# EAGLE design wisleep_revB (EAGLE 6.5.0)

## Sheet 1 of 2
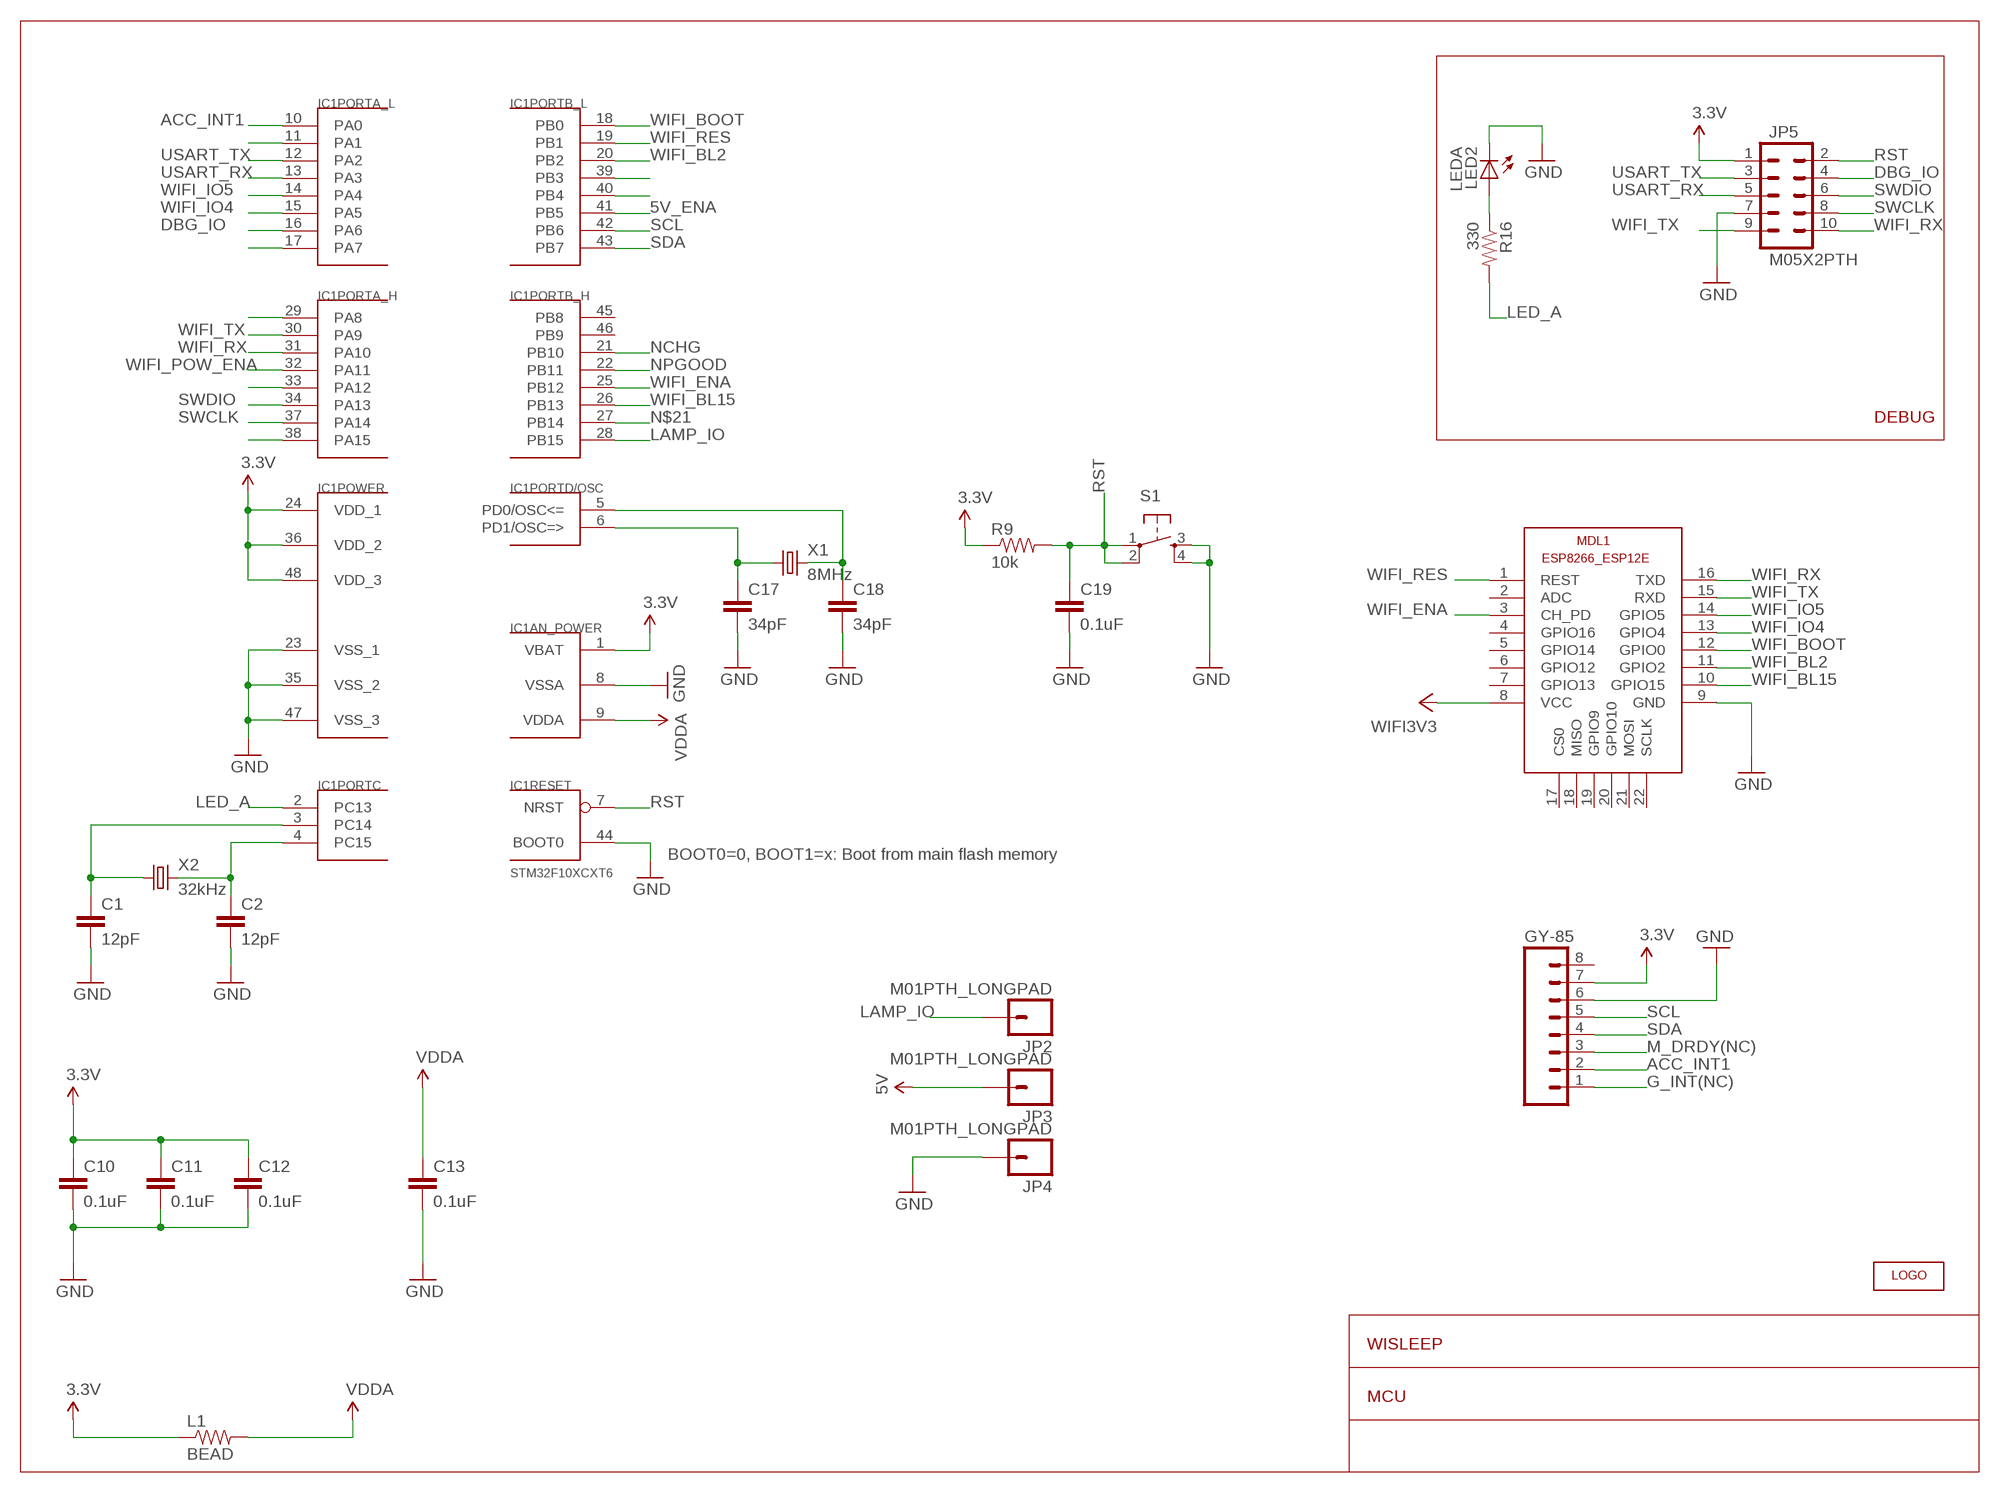
[diagram p0: schematic, sheet 1]

### Parts
C1  12pF  CAP0402  [C0402]
C2  12pF  CAP0402  [C0402]
C10  0.1uF  CAP0402  [C0402]
C11  0.1uF  CAP0402  [C0402]
C12  0.1uF  CAP0402  [C0402]
C13  0.1uF  CAP0402  [C0402]
C17  34pF  CAP0402  [C0402]
C18  34pF  CAP0402  [C0402]
C19  0.1uF  CAP0402  [C0402]
GY-85  M08  [1X08]
IC1  STM32F10XCXT6  [TQFP48]
JP2  M01PTH_LONGPAD  [1X01_LONGPAD]
JP3  M01PTH_LONGPAD  [1X01_LONGPAD]
JP4  M01PTH_LONGPAD  [1X01_LONGPAD]
JP5  M05X2PTH  [AVR_ICSP]
L1  BEAD  RESISTOR0603  [0603_GEN]
LED2  LEDA  LED0603  [LED-0603]
MDL1  ESP8266-12EESP8266-ESP12E  [ESP8266-ESP12E]
R9  10k  RESISTOR0402  [C0402]
R16  330  RESISTOR0402  [C0402]
S1  TAC_SWITCHSMD  [TACTILE_SWITCH_SMD]
U$7  LOGOLOGO  [LOGO]
X1  8MHz  CRYSTALOWN5X3.2_7A  [CRYSTAL_SMD_5X3.2_7A]
X2  32kHz  CRYSTAL  [CRYSTAL_SMD_2X0.6]

### Nets
3.3V: C10.1 C11.1 C12.1 GY-85.7 IC1.1(AN_POWER:VBAT) IC1.24(POWER:VDD_1) IC1.36(POWER:VDD_2) IC1.48(POWER:VDD_3) JP5.1 L1.1 R9.1 ; also sheet 2
5V: JP3.1 ; also sheet 2
5V_ENA: IC1.41(PORTB_L:PB5) ; also sheet 2
ACC_INT1: GY-85.2 IC1.10(PORTA_L:PA0)
DBG_IO: IC1.16(PORTA_L:PA6) JP5.4
G_INT(NC): GY-85.1
GND: C1.2 C2.2 C10.2 C11.2 C12.2 C13.2 C17.2 C18.2 C19.2 GY-85.6 IC1.8(AN_POWER:VSSA) IC1.23(POWER:VSS_1) IC1.35(POWER:VSS_2) IC1.44(RESET:BOOT0) IC1.47(POWER:VSS_3) JP4.1 JP5.7 LED2.C MDL1.9(GND) S1.3 S1.4 ; also sheet 2
LAMP_IO: IC1.28(PORTB_H:PB15) JP2.1
LED_A: IC1.2(PORTC:PC13) R16.2
M_DRDY(NC): GY-85.3
N$1: C1.1 IC1.3(PORTC:PC14) X2.P$1
N$2: C2.1 IC1.4(PORTC:PC15) X2.P$2
N$5: LED2.A R16.1
N$17: IC1.11(PORTA_L:PA1)
N$20: IC1.17(PORTA_L:PA7)
N$21: IC1.27(PORTB_H:PB14)
N$22: IC1.33(PORTA_H:PA12)
N$23: IC1.38(PORTA_H:PA15)
N$27: IC1.40(PORTB_L:PB4)
N$28: IC1.29(PORTA_H:PA8)
NCHG: IC1.21(PORTB_H:PB10) ; also sheet 2
NPGOOD: IC1.22(PORTB_H:PB11) ; also sheet 2
OSCI: C18.1 IC1.5(PORTD/OSC:PD0/OSC<=) X1.P$2
OSCO: C17.1 IC1.6(PORTD/OSC:PD1/OSC=>) X1.P$1
PB3: IC1.39(PORTB_L:PB3)
RST: C19.1 IC1.7(RESET:NRST) JP5.2 R9.2 S1.1 S1.2
SCL: GY-85.5 IC1.42(PORTB_L:PB6)
SDA: GY-85.4 IC1.43(PORTB_L:PB7)
SWCLK: IC1.37(PORTA_H:PA14) JP5.8
SWDIO: IC1.34(PORTA_H:PA13) JP5.6
USART_RX: IC1.13(PORTA_L:PA3) JP5.5
USART_TX: IC1.12(PORTA_L:PA2) JP5.3
VCC: MDL1.8(VCC) ; supply symbol labelled WIFI3V3 ; also sheet 2
VDDA: C13.1 IC1.9(AN_POWER:VDDA) L1.2
WIFI_BL2: IC1.20(PORTB_L:PB2) MDL1.11(GPIO2)
WIFI_BL15: IC1.26(PORTB_H:PB13) MDL1.10(GPIO15)
WIFI_BOOT: IC1.18(PORTB_L:PB0) MDL1.12(GPIO0)
WIFI_ENA: IC1.25(PORTB_H:PB12) MDL1.3(CH_PD)
WIFI_IO4: IC1.15(PORTA_L:PA5) MDL1.13(GPIO4)
WIFI_IO5: IC1.14(PORTA_L:PA4) MDL1.14(GPIO5)
WIFI_POW_ENA: IC1.32(PORTA_H:PA11) ; also sheet 2
WIFI_RES: IC1.19(PORTB_L:PB1) MDL1.1(REST)
WIFI_RX: IC1.31(PORTA_H:PA10) JP5.10 MDL1.16(TXD)
WIFI_TX: IC1.30(PORTA_H:PA9) JP5.9 MDL1.15(RXD)
Unconnected: GY-85.8 IC1.45(PORTB_H:PB8) IC1.46(PORTB_H:PB9) MDL1.2(ADC) MDL1.4(GPIO16) MDL1.5(GPIO14) MDL1.6(GPIO12) MDL1.7(GPIO13) MDL1.17(CS0) MDL1.18(MISO) MDL1.19(GPIO9) MDL1.20(GPIO10) MDL1.21(MOSI) MDL1.22(SCLK)

### Notes on the sheet
- DEBUG
- BOOT0=0, BOOT1=x: Boot from main flash memory
- WISLEEP
- MCU

## Sheet 2 of 2
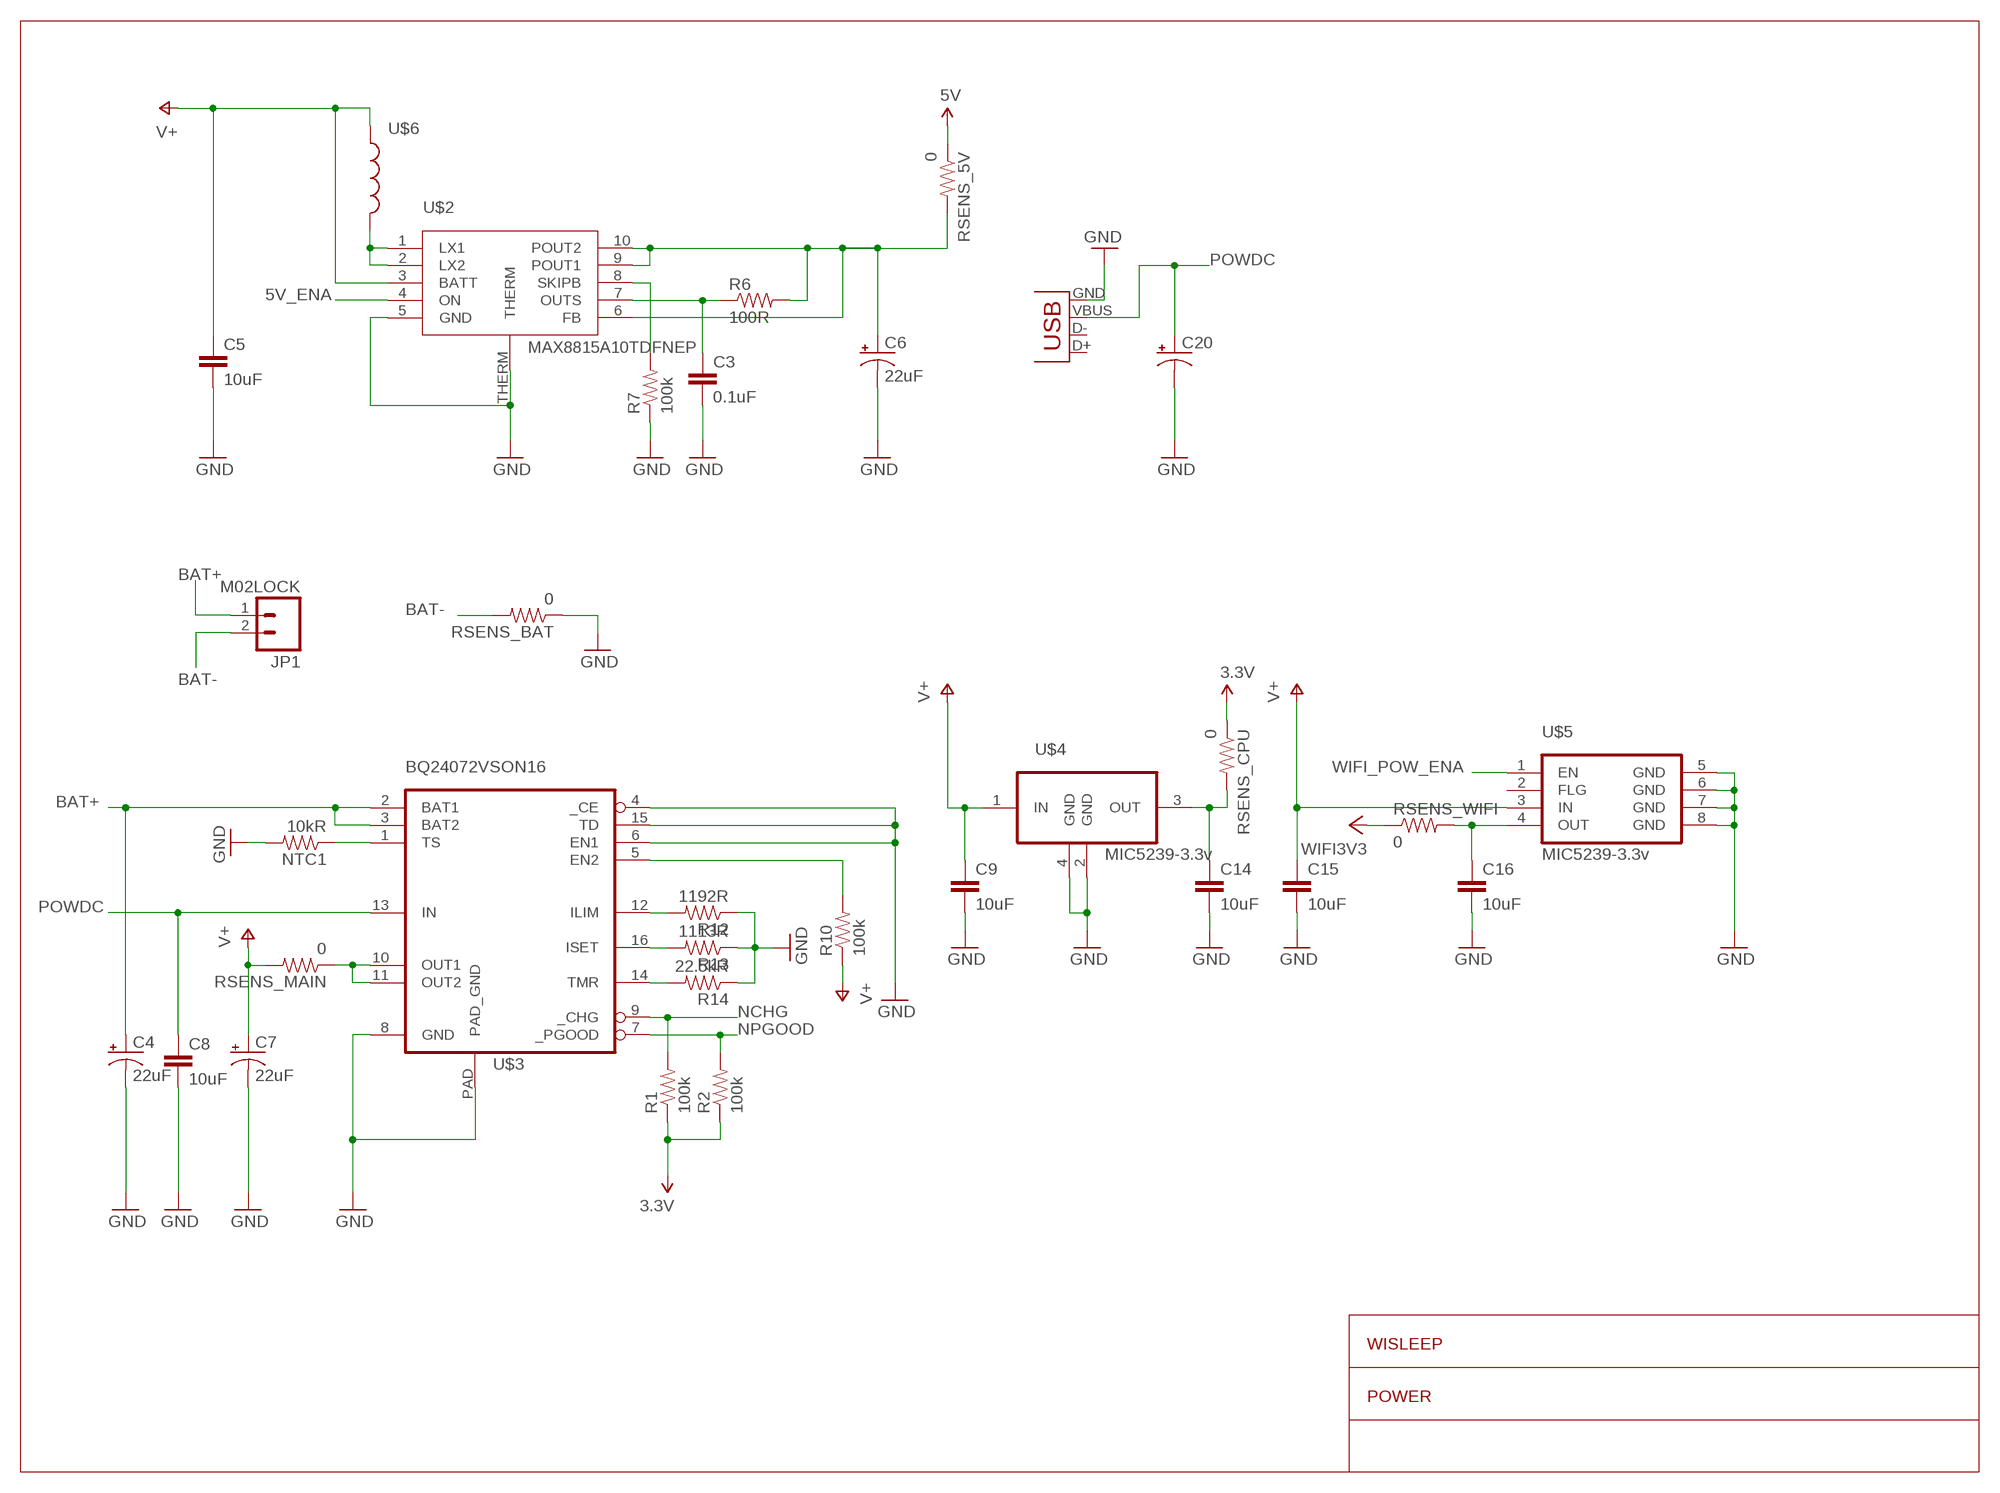
[diagram p1: schematic, sheet 2]

### Parts
C3  0.1uF  CAP0402  [C0402]
C4  22uF  CAP_POL1206_CASE-A  [EIA3216]
C5  10uF  CAP0402  [C0402]
C6  22uF  CAP_POL1206_CASE-A  [EIA3216]
C7  22uF  CAP_POL1206_CASE-A  [EIA3216]
C8  10uF  CAP0402  [C0402]
C9  10uF  CAP0402  [C0402]
C14  10uF  CAP0402  [C0402]
C15  10uF  CAP0402  [C0402]
C16  10uF  CAP0402  [C0402]
C20  CAP_POL6032  [EIA6032]
JP1  M02LOCK  [1X02_LOCK]
NTC1  10kR  RESISTOR0402  [C0402]
R1  100k  RESISTOR0402  [C0402]
R2  100k  RESISTOR0402  [C0402]
R6  100R  RESISTOR0402  [C0402]
R7  100k  RESISTOR0402  [C0402]
R10  100k  RESISTOR0402  [C0402]
R12  1192R  RESISTOR0402  [C0402]
R13  1113R  RESISTOR0402  [C0402]
R14  22.5kR  RESISTOR0402  [C0402]
RSENS_5V  0  RESISTOR0402  [C0402]
RSENS_BAT  0  RESISTOR0402  [C0402]
RSENS_CPU  0  RESISTOR0402  [C0402]
RSENS_MAIN  0  RESISTOR0402  [C0402]
RSENS_WIFI  0  RESISTOR0402  [C0402]
U$2  MAX8815A10TDFNEP  [10-TDFN-EP]
U$3  BQ24072VSON16  [VSON16]
U$4  MIC5239-3.3v  MIC5239SOT223SOT223  [SOT223]
U$5  MIC5239-3.3v  MIC5239-8MSOP  [MSOP08]
U$6  INDUCTOR3014  [INDUCTOR-3014]
X3  USB-MINIB  [USB-MINIB]

### Nets
3.3V: R1.1 R2.1 RSENS_CPU.1 ; also sheet 1
5V: RSENS_5V.1 ; also sheet 1
5V_ENA: U$2.4(ON) ; also sheet 1
BAT+: C4.A(+) JP1.1 U$3.2(BAT1) U$3.3(BAT2)
BAT-: JP1.2 RSENS_BAT.2
GND: C3.2 C4.C(-) C5.2 C6.C(-) C7.C(-) C8.2 C9.2 C14.2 C15.2 C16.2 C20.P$2(-) NTC1.2 R7.1 R12.1 R13.1 R14.1 RSENS_BAT.1 U$2.5(GND) U$2.THERM U$3.4(_CE) U$3.6(EN1) U$3.8(GND) U$3.15(TD) U$3.PAD(PAD_GND) U$4.2(GND) U$4.4(GND) U$5.5(GND) U$5.6(GND) U$5.7(GND) U$5.8(GND) X3.GND ; also sheet 1
N$3: C6.A(+) R6.2 RSENS_5V.2 U$2.6(FB) U$2.9(POUT1) U$2.10(POUT2)
N$4: RSENS_MAIN.1 U$3.10(OUT1) U$3.11(OUT2)
N$6: R14.2 U$3.14(TMR)
N$8: NTC1.1 U$3.1(TS)
N$9: R10.2 U$3.5(EN2)
N$11: R12.2 U$3.12(ILIM)
N$12: R13.2 U$3.16(ISET)
N$13: C14.1 RSENS_CPU.2 U$4.3(OUT)
N$14: C16.1 RSENS_WIFI.2 U$5.4(OUT)
N$15: U$2.1(LX1) U$2.2(LX2) U$6.P$2
N$16: C3.1 R6.1 U$2.7(OUTS)
N$19: R7.2 U$2.8(SKIPB)
NCHG: R1.2 U$3.9(_CHG) ; also sheet 1
NPGOOD: R2.2 U$3.7(_PGOOD) ; also sheet 1
POWDC: C8.1 C20.P$1(+) U$3.13(IN) X3.VBUS
V+: C5.1 C7.A(+) C9.1 C15.1 R10.1 RSENS_MAIN.2 U$2.3(BATT) U$4.1(IN) U$5.3(IN) U$6.P$1
VCC: RSENS_WIFI.1 ; supply symbol labelled WIFI3V3 ; also sheet 1
WIFI_POW_ENA: U$5.1(EN) ; also sheet 1
Unconnected: U$5.2(FLG) X3.D+ X3.D-

### Notes on the sheet
- WISLEEP
- POWER

## Library data of the parts
C1-C3 C5 C8-C19 = robot:CAP: Capacitor Standard 0603 ceramic capacitor, and 0.1" leaded capacitor.
C4 C6 C7 = robot:CAP_POL: Capacitor Polarized These are standard SMD and PTH capacitors. Normally 10uF, 47uF, and 100uF in electrolytic and tantalum varieties. Always verify the external diameter of the through hole cap, it varies with capacity, voltage, and manufacturer. The EIA devices should be standard.
C20 = SparkFun-Capacitors:CAP_POL: Capacitor Polarized These are standard SMD and PTH capacitors. Normally 10uF, 47uF, and 100uF in electrolytic and tantalum varieties. Always verify the external diameter of the through hole cap, it varies with capacity, voltage, and manufacturer. The EIA devices should be standard.
GY-85 = robot:M08: Header 8 Standard 8-pin 0.1" header. Use with straight break away headers (SKU : PRT-00116), right angle break away headers (PRT-00553), swiss pins (PRT-00743), machine pins (PRT-00117), and female headers (PRT-00115).
IC1 = stm32:STM32F10XCXT6: ST STM32F101/103 48pin LQFP
JP1 = SparkFun-Connectors:M02: Standard 2-pin 0.1" header. Use with - straight break away headers ( PRT-00116) - right angle break away headers (PRT-00553) - swiss pins (PRT-00743) - machine pins (PRT-00117) - female headers (PRT-00115) Molex polarized connector foot print use with: PRT-08233 with associated crimp pins and housings. 2.54_SCREWTERM for use with PRT-10571. 3.5mm Screw Terminal footprints for PRT-08084 5mm Screw Terminal footprints for use with PRT-08433
JP2-JP4 = SparkFun-Connectors:M01: Header 1 Standard 1-pin 0.1" header. Use with straight break away headers (SKU : PRT-00116), right angle break away headers (PRT-00553), swiss pins (PRT-00743), machine pins (PRT-00117), and female headers (PRT-00115).
JP5 = SparkFun-Connectors:M05X2: Header 5x2 Standard 10-pin dual row 0.1" header. Commonly used with AVR-ISP. Use with Spark Fun Electronics SKU: PRT-00778
L1 = robot:RESISTOR: Resistor Basic schematic elements and footprints for 0603, 1206, and PTH 1/10th watt (small) resistors.
LED2 = SparkFunEagle-6-6-07:LED: LEDs Standard schematic elements and footprints for 5mm, 3mm, 1206, and 0603 sized LEDs. 5mm - Spark Fun Electronics SKU : COM-00529 (and others)
MDL1 = ESP8266-ESP12E:ESP8266-12E: ESP8266-12E with additional I/O and GPIO04/05 corrected The author cannot warrant that this library is free from error or will meet your specific requirements. Created by PuceBaboon.com. Komagane, Nagano, JAPAN
NTC1 R1 R2 R6 R7 R9 R10 R12-R14 R16 RSENS_5V RSENS_BAT RSENS_CPU RSENS_MAIN RSENS_WIFI = SparkFunEagle-6-6-07:RESISTOR: Resistor Basic schematic elements and footprints for 0603, 1206, and PTH 1/10th watt (small) resistors.
S1 = SparkFun-Electromechanical:TAC_SWITCH: Momentary Switch Button commonly used for reset or general input. Spark Fun Electronics SKU : COM-00097 SMT- SWCH-08247; PROD_ID: SWCH-08247
U$2 = robot:MAX8815A
U$3 = robot:BQ24072: bq24072 1.5-A USB-Friendly Li-Ion Battery Charger and Power-Path Management IC
U$4 = robot:MIC5239SOT223
U$5 = robot:MIC5239-8
U$6 = robot:INDUCTOR: Inductors Basic Inductor/Choke - 0603 and 1206. Footprints are not proven and vary greatly between part numbers.
U$7 = robot:LOGO
X1 X2 = robot:CRYSTAL: Crystals Various standard crystals. Proven footprints. Spark Fun Electronics SKU : COM-00534
X3 = robot:USB: USB Connectors USB-B-PTH is fully proven SKU : PRT-00139 USB-miniB is fully proven SKU : PRT-00587 USB-A-H is throughly reviewed, but untested. Spark Fun Electronics SKU : PRT-00437 USB-B-SMT is throughly reviewed, but untested. Needs silkscreen touching up. USB-A-S has not been used/tested USB-MB-H has not been used/tested

## Board
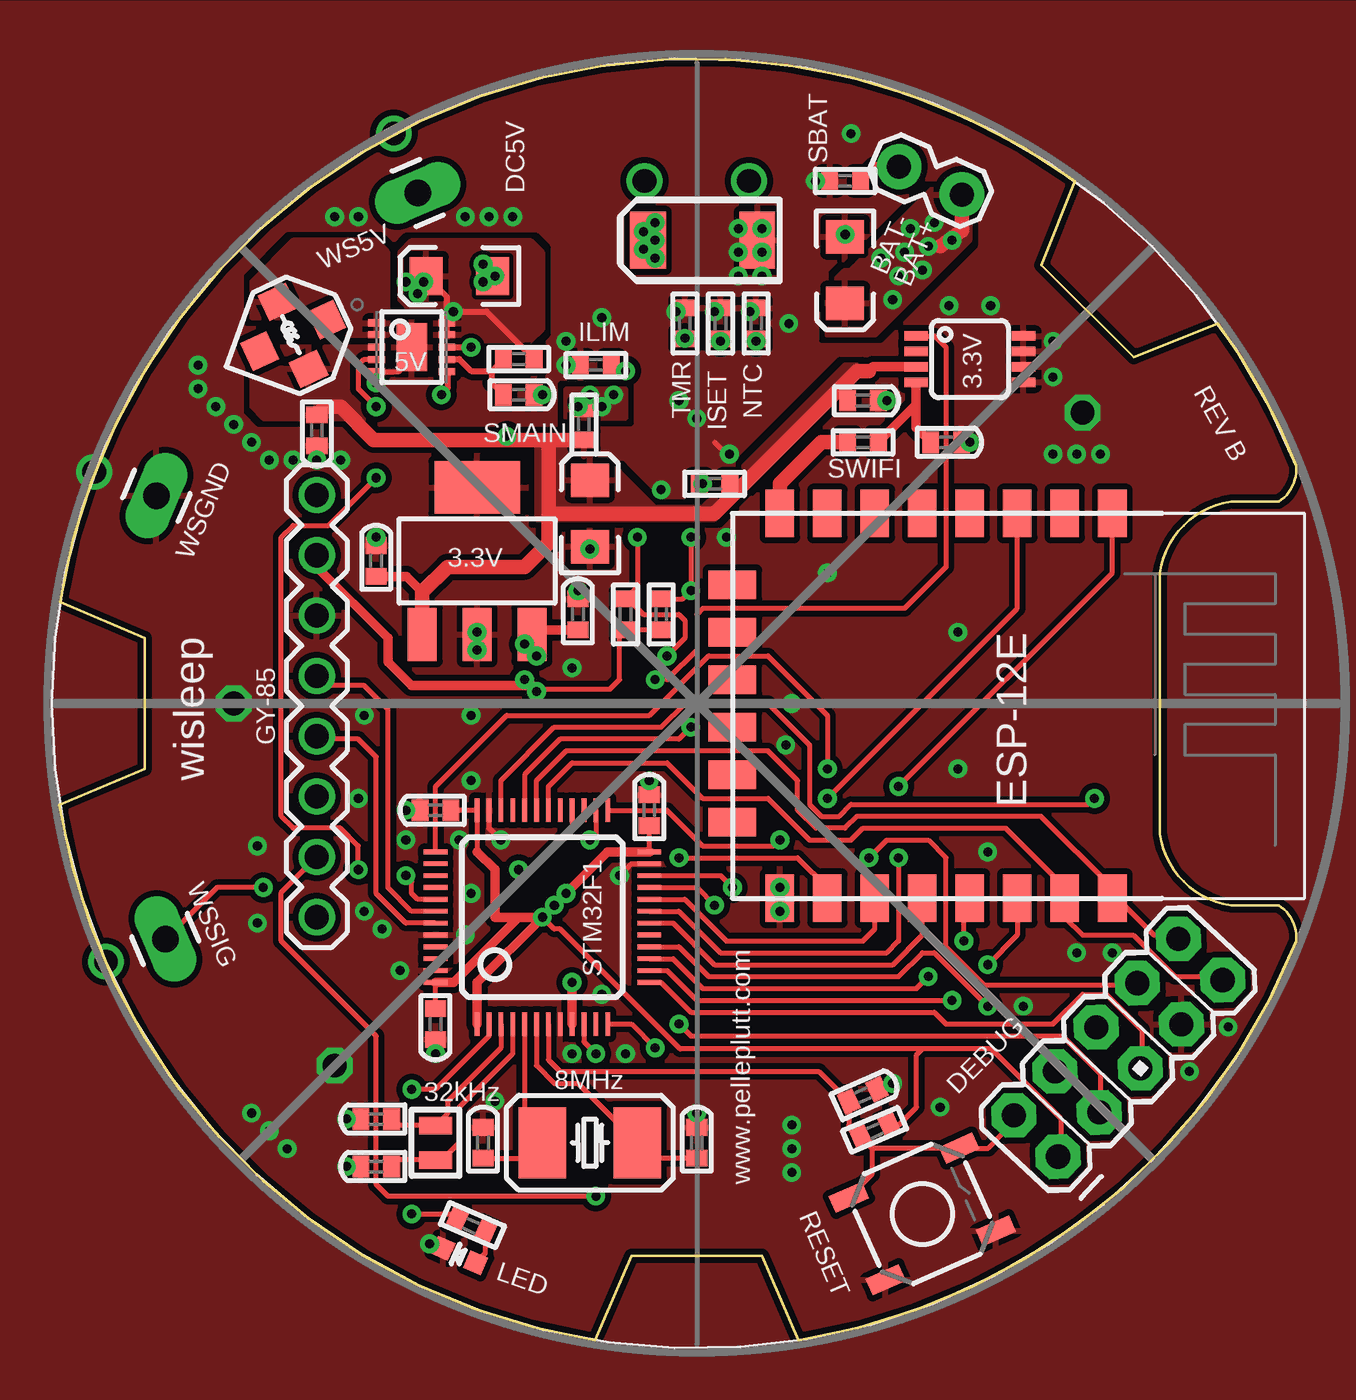
[diagram p2: board, top side]
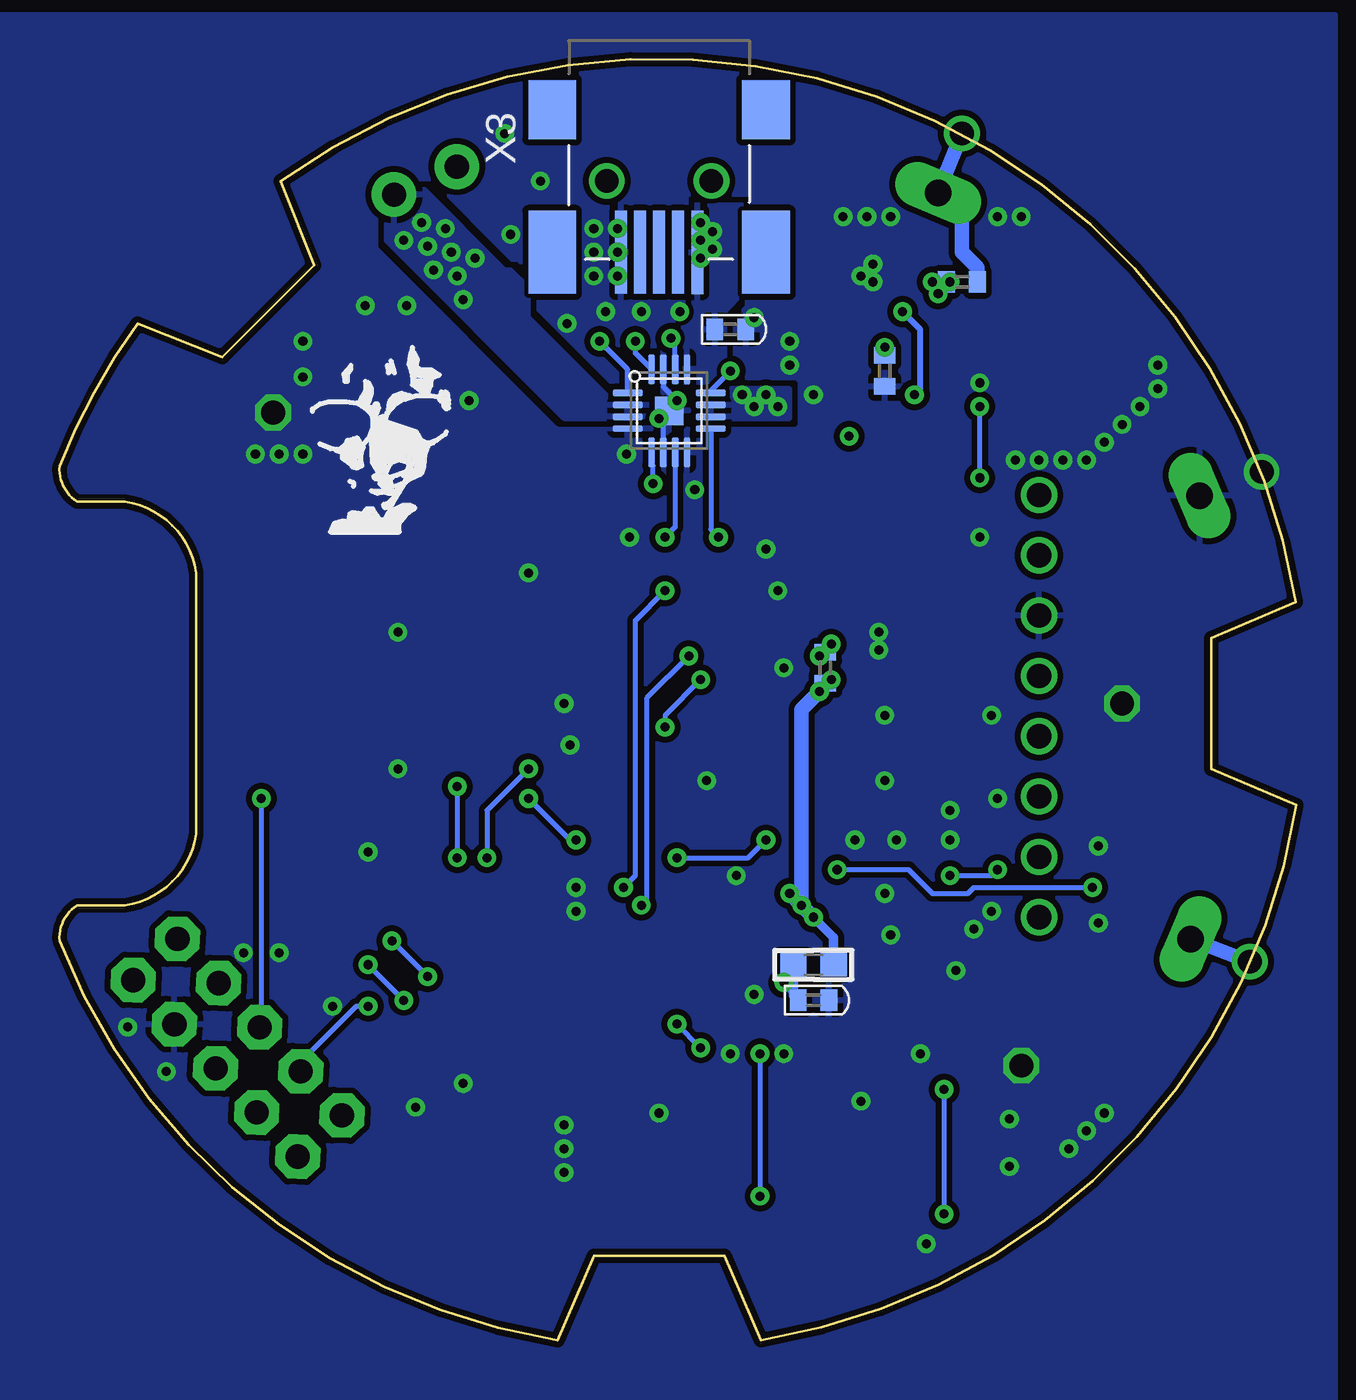
[diagram p3: board, bottom side, seen from below]

Size 52.09 x 53.93 mm. Coordinates in mm from the lower left corner, seen from the top.
Outline: 42.77,48.8 41.36,45.27 45.25,41.38 48.79,42.8 arc-14 52.09,36.81 arc-62 51.34,35.31 49.34,35.31 arc74 46.34,32.31 46.34,21.31 arc74 49.34,18.31 51.34,18.31 arc-62 52.09,16.81 arc-59 31.12,0 29.59,3.56 24.09,3.56 22.56,0 arc-72 0,22.53 3.59,24.06 3.59,29.56 0.03,31.08 arc-117 42.77,48.8
Copper layers (1*16): Top 0.035mm / dielectric 1.5mm / Bottom 0.035mm
Design rules "batchpcb_onthelimits *": minimum track width 7mil, minimum drill 15mil, track to track 7mil, track to pad 7mil, pad to pad 7mil, via to via 7mil, smd to smd 7mil, copper to edge 10mil, drill to drill 7mil, minimum pad ring 10mil, minimum via ring 8mil, stop-mask expansion 4mil, vias tented up to drill 15mil, thermal gap 10mil

### Footprints (pad centres in the part's own frame; a part is rotated, then mirrored left to right if it is on the bottom)
C0402 = smd 0.7 x 0.9: 1 -0.65,0; 2 0.65,0
EIA3216 = smd 1.4 x 1.6: A 1.4,0; C -1.4,0
EIA6032 = smd 1.5 x 2.4: P$1 -2.3,0; P$2 2.3,0
1X08 = drill 1.016: 1 0,0; 2 2.54,0; 3 5.08,0; 4 7.62,0; 5 10.16,0; 6 12.7,0; 7 15.24,0; 8 17.78,0
TQFP48 = smd 0.2 x 1: 1 -2.75,-4.5; 2 -2.25,-4.5; 3 -1.75,-4.5; 4 -1.25,-4.5; 5 -0.75,-4.5; 6 -0.25,-4.5; 7 0.25,-4.5; 8 0.75,-4.5; 9 1.25,-4.5; 10 1.75,-4.5; 11 2.25,-4.5; 12 2.75,-4.5; 25 2.75,4.5; 26 2.25,4.5; 27 1.75,4.5; 28 1.25,4.5; 29 0.75,4.5; 30 0.25,4.5; 31 -0.25,4.5; 32 -0.75,4.5; 33 -1.25,4.5; 34 -1.75,4.5; 35 -2.25,4.5; 36 -2.75,4.5 | smd 1 x 0.2: 13 4.5,-2.75; 14 4.5,-2.25; 15 4.5,-1.75; 16 4.5,-1.25; 17 4.5,-0.75; 18 4.5,-0.25; 19 4.5,0.25; 20 4.5,0.75; 21 4.5,1.25; 22 4.5,1.75; 23 4.5,2.25; 24 4.5,2.75; 37 -4.5,2.75; 38 -4.5,2.25; 39 -4.5,1.75; 40 -4.5,1.25; 41 -4.5,0.75; 42 -4.5,0.25; 43 -4.5,-0.25; 44 -4.5,-0.75; 45 -4.5,-1.25; 46 -4.5,-1.75; 47 -4.5,-2.25; 48 -4.5,-2.75
1X02_LOCK = drill 1.016 pad 1.88: 1 -0.178,0; 2 2.718,0
1X01_LONGPAD = drill 1.118 pad 1.88 long: 1 0,0
AVR_ICSP = drill 1.016 pad 1.88 octagon: 1 -1.27,5.08; 2 1.27,5.08; 3 -1.27,2.54; 4 1.27,2.54; 5 -1.27,0; 6 1.27,0; 7 -1.27,-2.54; 8 1.27,-2.54; 9 -1.27,-5.08; 10 1.27,-5.08
0603_GEN = smd 1.1 x 1: 1 -0.85,0; 2 0.85,0
LED-0603 = smd 0.8 x 0.8: A 0,-0.75; C 0,0.75
ESP8266-ESP12E = smd 2 x 1.2: 1 0,16; 2 0,14; 3 0,12; 4 0,10; 5 0,8; 6 0,6; 7 0,4; 8 0,2; 9 16.2,2; 10 16.2,4; 11 16.2,6; 12 16.2,8; 13 16.2,10; 14 16.2,12; 15 16.2,14; 16 16.2,16 | smd 1.2 x 2: 17 11,0; 18 3,0; 19 5,0; 20 13,0; 21 7,0; 22 9,0
TACTILE_SWITCH_SMD = smd 1.524 x 0.762: 1 -2.54,1.905; 2 2.54,1.905; 3 -2.54,-1.905; 4 2.54,-1.905
10-TDFN-EP = smd 0.7 x 0.3: 1 -1.48,1.025; 2 -1.48,0.525; 3 -1.48,0; 4 -1.48,-0.525; 5 -1.48,-1.025; 6 1.48,-1.025; 7 1.48,-0.525; 8 1.48,0; 9 1.48,0.525; 10 1.48,1.025 | smd 1.27 x 2.032: THERM 0,0
VSON16 = smd 1.25 x 0.28: 1 -1.75,0.75; 2 -1.75,0.25; 3 -1.75,-0.25; 4 -1.75,-0.75; 9 1.75,-0.75; 10 1.75,-0.25; 11 1.75,0.25; 12 1.75,0.75 | smd 0.28 x 1.25: 5 -0.75,-1.75; 6 -0.25,-1.75; 7 0.25,-1.75; 8 0.75,-1.75; 13 0.75,1.75; 14 0.25,1.75; 15 -0.25,1.75; 16 -0.75,1.75 | smd 1.2 x 1.2: PAD 0,0
SOT223 = smd 1.219 x 2.235: 1 -2.311,-3.099; 2 0,-3.099; 3 2.311,-3.099 | smd 3.6 x 2.2: 4 0,3.099
MSOP08 = smd 0.4 x 1: 1 -0.976,-2.263; 2 -0.326,-2.263; 3 0.324,-2.263; 4 0.974,-2.263; 5 0.974,2.262; 6 0.324,2.262; 7 -0.326,2.262; 8 -0.976,2.262
INDUCTOR-3014 = smd 1.3 x 1.2 rotated 45: NC1 -1.1,1.1 | smd 1.3 x 1.2 rotated 225: NC2 1.1,-1.1 | smd 1.3 x 1.2 rotated 135: P$1 -1.1,-1.1 | smd 1.3 x 1.2 rotated 315: P$2 1.1,1.1
CRYSTAL_SMD_5X3.2_7A = smd 2 x 3: P$1 -2,0; P$2 2,0
CRYSTAL_SMD_2X0.6 = smd 0.75 x 1.4: P$1 -0.725,0; P$2 0.725,0
USB-MINIB = smd 2.5 x 2: 1 -3,-4.5; 2 -3,4.5 | smd 3.5 x 2: 3 3,-4.5; 4 3,4.5 | smd 3.5 x 0.5: D+ 3,0; D- 3,0.8; GND 3,-1.6; ID 3,-0.8; VBUS 3.01,1.61 | drill 1 pad 1.27: P$1 0,2.2; P$2 0,-2.2

### Placement (x,y rotation side)
C1  13.34,9.31 180 top
C2  13.34,7.31 180 top
C3  19.34,39.81 0 top
C4  33.09,45.06 270 top
C5  10.84,38.31 270 top
C6  16.84,44.81 180 top
C7  22.34,34.81 90 top
C8  23.84,42.56 0 bottom
C9  13.34,32.81 90 top
C10  15.84,22.31 180 top
C11  24.84,22.31 90 top
C12  15.84,13.31 270 top
C13  20.34,14.31 0 bottom
C14  21.84,30.56 90 top
C15  33.84,39.56 0 top
C16  37.34,37.81 0 top
C17  26.84,8.31 90 top
C18  17.84,8.31 90 top
C19  33.84,10.31 24 top
C20  27.09,46.31 0 top
GY-85  10.84,17.81 90 top
IC1  20.34,17.81 0 top
JP1  37.84,48.31 156 top
JP2  4.47,16.89 203 top
JP3  15.09,48.31 113 top
JP4  4.08,35.56 337 top
JP5  44.59,12.31 137 top
L1  20.34,15.81 180 bottom
LED2  16.84,3.56 66 top
MDL1  28.34,34.81 270 top
NTC1  29.34,42.81 90 top
R1  23.84,30.56 90 top
R2  25.34,30.56 90 top
R6  19.34,41.31 0 top
R7  17.34,40.81 90 bottom
R9  34.34,8.81 204 top
R10  27.59,36.06 180 top
R12  22.59,41.06 0 top
R13  27.84,42.81 270 top
R14  26.34,42.81 270 top
R16  17.34,4.81 156 top
RSENS_5V  14.09,44.56 180 bottom
RSENS_BAT  33.09,48.81 0 top
RSENS_CPU  19.84,28.31 90 bottom
RSENS_MAIN  22.09,38.56 270 top
RSENS_WIFI  33.84,37.81 0 top
S1  36.34,5.31 24 top
U$2  14.84,41.81 0 top
U$3  26.41,39.13 0 bottom
U$4  17.59,32.81 0 top
U$5  38.34,41.31 270 top
U$6  9.84,42.31 70 top
U$7  38.44,38.35 0 bottom
X1  22.34,8.31 180 top
X2  15.84,8.31 270 top
X3  26.84,48.81 270 bottom

### Tracks (layer width: path | path; a pad name or v marks a point on that pad's centre or on a via)
3.3V  (via drill 0.38)
  Top 0.2: C12.1 IC1.48 | C10.1 IC1.36 17.59,20.56 | IC1.24 C11.1 | 36.34,12.26 39.24,12.26 42.17,9.33 42.17,7.84 JP5.1 | 36.34,12.26 26.14,12.26 21.09,17.31 20.84,17.31 v20.34,17.81 | R9.1 35.35,9.07 36.09,9.81 36.09,12.01 36.34,12.26 | 20.09,27.41 19.99,27.41 v19.59,27.81 19.69,27.81 20.09,27.41 | 20.09,27.41 23.19,27.41 23.59,27.81 23.59,29.66 R1.1 R2.1
  Top 0.4: 17.59,20.56 18.34,19.81 18.34,17.81 v20.34,17.81 | IC1.24 23.09,20.56 v21.34,18.81 | IC1.1 17.59,15.06 v20.34,17.81 | IC1.48 16.59,15.06 19.34,17.81 v20.34,17.81 | GY-85.7 10.84,32.56 13.84,29.56 13.84,28.56 14.84,27.56 19.74,27.56 RSENS_CPU.1 19.84,27.56 v20.09,27.31
  Bottom 0.4: L1.1 19.49,16.96 v20.34,17.81 | v19.59,27.81 19.69,27.81 RSENS_CPU.1 20.09,27.41 v20.09,27.31
  Bottom 0.6: v20.09,27.31 20.34,27.06 20.84,26.56 v20.84,18.31 | v20.84,18.31 v21.34,18.81 v20.34,17.81 v20.84,18.31
5V  (via drill 1 pad 0.8)
  Bottom 0.6: RSENS_5V.1 13.44,45.16 14.09,45.81 14.09,47.31 JP3.1 v14.09,50.81
5V_ENA  (via drill 0.38)
  Top 0.2: U$2.4 12.81,41.29 12.59,41.06 12.59,40.06 v13.34,39.31 | v12.59,19.81 12.59,20.81 11.84,21.56 9.84,21.56 9.34,22.06 9.34,33.81 9.84,34.31 11.34,34.31 v13.34,36.31 | IC1.41 15.09,18.56 14.84,18.81 14.84,19.31 v14.59,19.56
  Bottom 0.2: v13.34,36.31 v13.34,39.31 | v14.59,19.56 12.84,19.56 v12.59,19.81
ACC_INT1  (via drill 0.38)
  Top 0.2: IC1.10 22.09,12.56 v22.59,12.06 | v22.59,6.06 13.84,6.06 13.34,6.56 13.34,12.81 9.34,16.81 9.34,18.85 GY-85.2
  Bottom 0.2: v22.59,12.06 v22.59,6.06
BAT+  (via drill 0.38)
  Top 0.6: JP1.1 38,46.72 37.09,46.06
  other vias: 35.09,43.81 36.34,45.06 37.59,46.31 36.59,46.06 35.34,44.81 35.59,45.81 36.84,47.06 34.59,45.56 35.84,46.81
  pour Top (rank 2): 32.34,42.31 32.34,44.31 33.09,45.06 33.34,45.06 36.84,48.56 38.34,48.56 38.34,46.31 34.34,42.31
  pour Bottom: 27.34,39.56 28.84,39.56 32.34,43.06 32.34,44.31 33.09,45.06 33.34,45.06 36.84,48.56 38.34,48.56 38.34,46.31 30.84,38.81 27.34,38.81
BAT-
  Top 0.4: JP1.2 34.35,49.41 RSENS_BAT.2
DBG_IO  (via drill 0.38)
  Top 0.2: IC1.16 26.09,16.56 27.34,15.31 35.34,15.31 36.34,16.31 36.84,16.31 v39.09,14.06
  Bottom 0.2: v39.09,14.06 39.59,14.06 42.05,11.61 42.05,11.44 JP5.4
GND  (via drill 0.38 pad 0.69, 1, 1 pad 0.8)
  Top 0.2: U$2.THERM 14.34,41.31 14.34,40.81 14.31,40.79 U$2.5 13.36,40.33 v13.34,40.31 | IC1.35 18.09,21.56 v18.59,21.06 | IC1.23 24.09,20.06 v23.59,19.56 | 27.59,37.81 27.84,37.56 | NTC1.2 v29.09,43.31
  Top 0.6: v18.34,44.81 C6.C | C3.2 v20.34,39.81
  Bottom 0.2: U$3.15 26.66,40.13 v26.09,39.56 | U$3.6 26.66,38.63 v26.84,38.81
  other vias: 18.34,10.06 17.09,17.06 21.59,12.06 14.59,22.31 24.84,23.56 15.84,12.06 12.09,9.31 12.09,7.31 26.84,9.56 41.84,42.06 41.84,40.56 17.59,29.81 17.59,29.06 35.09,10.81 15.59,4.06 12.59,22.81 12.84,18.06 30.34,19.06 30.34,18.06 28.59,46.81 25.96,43.31 33.09,46.56 22.34,33.31 21.34,41.06 21.84,31.56 13.34,33.81 34.84,39.56 38.34,37.81 31.84,48.81 8.84,8.81 8.09,9.56 9.59,8.06 11.59,47.31 12.59,47.31 21.34,42.06 17.09,47.31 18.09,47.31 19.09,47.31 10.84,37.06 11.84,37.06 9.84,37.06 8.84,37.06 8.09,37.81 7.34,38.56 6.59,39.31 5.84,40.06 5.84,41.06 32.34,32.31 40.59,14.06 30.84,26.81 14.34,15.56 8.34,17.56 8.34,20.81 14.59,21.06 13.59,17.31 22.84,14.56 17.34,18.81 17.34,23.56 16.84,21.06 30.59,25.06 37.84,24.06 37.84,29.81 21.59,28.31 17.34,26.31 17.84,44.56 17.84,45.31 42.84,16.31 44.34,16.31 25.34,35.81 41.84,37.31 42.84,37.31 43.84,37.31 33.34,50.81 30.84,9.06 30.84,8.06 30.84,7.06 23.84,12.06 37.09,9.81 39.09,20.56 12.84,26.31 11.59,11.56 7.34,26.81 43.09,39.06 27.59,43.31 47.59,11.31 49.22,13.19 28.59,45.81 28.59,44.81 29.59,46.81 29.59,45.81 29.59,44.81 22.84,43.06 30.71,42.81 28.21,37.31 37.47,43.56 39.22,43.56 28.09,33.81 1.47,36.56
  pour Bottom (isolate 0.25, rank 2): -1.66,55.81 57.34,55.81 57.34,-2.69 -1.66,-2.69
  pour Top (isolate 0.25, rank 6): -2.66,56.31 56.84,56.31 56.84,-4.69 -2.66,-4.69
LAMP_IO  (via drill 0.38, 1 pad 0.8)
  Top 0.2: IC1.28 21.59,21.56 19.84,19.81 v19.34,19.81 | v8.59,19.06 6.64,19.06 JP2.1
  Bottom 0.2: v19.34,19.81 16.34,19.81 15.34,18.81 13.84,18.81 13.59,19.06 v8.59,19.06
  Bottom 0.6: JP2.1 v1.97,15.94
LED_A  (via drill 0.38)
  Top 0.2: IC1.2 18.09,12.81 15.84,10.56 v14.84,10.56 | v14.84,5.31 16.51,5.31 R16.2
  Bottom 0.2: v14.84,10.56 v14.84,5.31
N$1
  Top 0.2: IC1.3 18.59,12.31 16.34,10.06 16.34,9.54 X2.P$1 14.27,9.04 C1.1
N$2
  Top 0.2: IC1.4 19.09,12.06 16.84,9.81 16.84,8.31 16.11,7.58 X2.P$2 14.27,7.58 C2.1
N$3  (via drill 0.38, 0.38 pad 0.38)
  Top 0.2: U$2.6 16.34,40.81 16.34,40.8 | U$2.10 U$2.9 | 16.32,42.79 16.34,43.31
  Top 0.25: 16.34,43.31 v16.59,43.31 | v16.59,43.31 17.99,43.31 R6.2 | C6.A 16.32,43.93 U$2.10 16.59,43.11 v16.59,43.31 | 16.34,40.81 16.34,40.32 16.34,40.31 16.34,40.06 v16.09,39.81
  Bottom 0.25: v16.09,39.81 15.84,40.06 15.84,42.56 v16.59,43.31
  Bottom 0.6: RSENS_5V.2 15.19,44.41 v15.34,44.56 | v14.59,44.56 RSENS_5V.2 | 14.94,44.56 RSENS_5V.2
  other vias: 15.09,44.06
  pour Top (rank 2): 15.84,42.06 15.84,43.31 14.84,43.31 14.34,43.81 14.34,45.81 14.84,46.31 19.84,46.31 20.34,45.81 20.34,42.56 19.84,42.06
N$4  (via drill 0.38)
  Top 0.2: 22.24,39.06 RSENS_MAIN.1
  other vias: 23.34,39.81 22.84,39.31 22.34,39.81 21.84,39.31
  pour Top: 21.34,40.06 23.84,40.06 23.84,38.81 21.34,38.81
  pour Bottom: 21.34,40.06 23.84,40.06 23.84,39.56 24.84,39.56 24.84,38.81 21.34,38.81
N$5
  Top 0.2: R16.1 17.93,3.66 LED2.A
N$6  (via drill 0.38)
  Top 0.2: R14.2 v26.34,42.19
  Bottom 0.2: U$3.14 26.16,42.01 v26.34,42.19
N$8  (via drill 0.38)
  Top 0.2: v29.34,42.06 29.09,41.91 NTC1.1
  Bottom 0.2: U$3.1 28.16,40.88 v29.34,42.06
N$9  (via drill 0.38)
  Top 0.2: R10.2 v27.09,36.06
  Bottom 0.2: U$3.5 27.16,36.88 27.09,36.81 v27.09,36.06
N$11  (via drill 0.38)
  Top 0.2: v23.84,40.81 23.49,40.81 R12.2
  Bottom 0.2: U$3.12 24.66,39.99 v23.84,40.81
N$12  (via drill 0.38)
  Top 0.2: v27.84,42.06 R13.2
  Bottom 0.2: U$3.16 | U$3.16 27.84,41.56 v27.84,42.06
N$13  (via drill 0.38)
  Top 0.2: v19.59,29.31 19.59,29.4 U$4.3
  Top 0.4: C14.1 20.1,29.91 U$4.3
  Bottom 0.4: v19.59,29.31 19.59,29.21 RSENS_CPU.2 19.99,28.81 v20.09,28.81
N$14
  Top 0.4: U$5.4 36.08,39.4 | 36.08,39.4 RSENS_WIFI.2 | 36.08,39.4 36.08,38.42 C16.1
N$15
  pour Top (isolate 0.25, rank 2): 10.34,43.06 11.09,42.31 13.84,42.31 13.84,45.81 13.34,46.31 9.84,46.31 8.09,44.56 8.09,43.06
N$16
  Top 0.25: U$2.7 16.34,41.31 16.84,41.31 17.34,40.81 18.19,40.81 | 18.19,40.81 R6.1 | 18.19,40.81 18.19,40.31 C3.1
N$19  (via drill 0.38 pad 0.69)
  Top 0.25: U$2.8 v17.34,41.81
  Bottom 0.25: R7.2 v17.34,41.81
NCHG  (via drill 0.38)
  Top 0.2: IC1.21 26.84,19.06 v27.59,18.31 | v24.34,33.81 24.34,31.71 R1.2 23.94,31.21 24.59,30.56 26.09,30.56 26.34,30.31 26.34,29.56 v25.59,28.81
  Bottom 0.2: v27.59,18.31 27.34,18.31 27.34,27.06 v25.59,28.81 | U$3.9 24.66,34.13 v24.34,33.81
NPGOOD  (via drill 0.38)
  Top 0.2: IC1.22 27.84,19.56 v28.34,19.06 | v26.59,33.81 v26.59,31.56 26.24,31.21 R2.2
  Bottom 0.2: v28.34,19.06 27.84,19.56 27.84,30.31 v26.59,31.56 | U$3.7 26.16,34.24 v26.59,33.81
OSCI
  Top 0.2: IC1.5 19.59,9.06 X1.P$2 19.69,7.66 C18.1
OSCO
  Top 0.2: IC1.6 20.09,11.56 20.84,10.81 21.84,10.81 X1.P$1 24.99,7.66 C17.1
POWDC  (via drill 0.38 pad 0.38)
  Top 0.2: v24.59,45.94 24.59,46.11 C20.P$1 v25.09,46.31 | v25.09,47.06 24.96,47.06 v24.59,46.69
  Bottom 0.2: X3.VBUS 25.23,45.7 v25.09,45.56
  pour Bottom: 24.84,40.31 25.84,40.31 25.84,47.81 23.34,47.81 23.34,44.06 24.09,43.31 24.09,41.06
RST
  Top 0.2: 34.21,8.08 S1.2 39.11,8.08 39.84,8.81 39.84,9.1 JP5.2 | 34.21,8.08 R9.2 33.25,9.05 C19.1 31.98,11.31 21.09,11.31 20.59,11.81 IC1.7 | 34.21,8.08 34.21,6.98 S1.1
SCL
  Top 0.2: IC1.42 14.84,18.06 13.84,19.06 13.84,26.56 12.84,27.56 11.25,27.56 GY-85.5
SDA
  Top 0.2: IC1.43 14.59,17.56 13.34,18.81 13.34,24.56 12.59,25.31 10.96,25.31 GY-85.4
SWCLK  (via drill 0.38)
  Top 0.2: IC1.37 15.84,23.31 18.84,26.31 24.84,26.31 27.34,28.81 29.84,28.81 32.34,26.31 v32.34,24.06 | v34.09,20.31 34.84,21.06 36.59,21.06 37.34,20.31 37.34,16.56 38.94,14.96 45.32,14.96 JP5.8
  Bottom 0.2: v32.34,24.06 34.09,22.31 v34.09,20.31
SWDIO  (via drill 0.38)
  Top 0.2: IC1.34 18.59,23.56 20.84,25.81 25.34,25.81 26.34,26.81 29.84,26.81 31.59,25.06 31.59,22.56 32.09,22.06 32.84,22.06 33.34,22.56 43.34,22.56 v43.59,22.81
  Bottom 0.2: v43.59,22.81 43.59,13.25 JP5.6
USART_RX
  Top 0.2: IC1.13 25.34,15.06 26.59,13.81 36.84,13.81 37.34,13.31 41.84,13.31 43.09,14.56 44.09,14.56 45.59,13.06 45.59,11.42 45.56,11.44 JP5.5
USART_TX  (via drill 0.38)
  Top 0.2: v26.09,13.31 26.59,12.81 42.24,12.81 43.84,11.21 43.84,9.58 43.83,9.59 JP5.3 | IC1.12 24.09,13.31 v25.09,12.31
  Bottom 0.2: v25.09,12.31 v26.09,13.31
V+  (via drill 0.38)
  Top 0.4: U$5.3 34.27,40.99 34.09,40.81 | C9.1 14.62,32.16 15.28,31.5 | C15.1 33.19,40.41 33.59,40.81
  Top 0.406: 20.59,37.91 18.84,37.91 v18.84,38.06
  Top 0.6: 20.59,34.81 20.59,33.56 19.59,32.56 16.34,32.56 15.28,31.5 U$4.1 | RSENS_MAIN.2 20.59,37.91 | 20.59,37.91 13.24,37.91 11.84,39.31 11.19,39.31 C5.1 | 34.09,40.81 33.59,40.81 27.59,34.81 20.59,34.81 | 20.59,34.81 20.59,37.91
  pour Top (isolate 0.25, rank 2): 13.34,41.81 8.59,41.81 8.09,41.31 8.09,39.31 8.59,38.81 13.84,38.81 13.84,40.31 13.34,40.31
  pour Top (isolate 0.1): 22.09,38.06 20.09,38.06 20.09,34.56 27.59,34.56 33.59,40.56 33.59,41.06 33.09,41.06 27.09,35.06 25.09,35.06
VCC
  Top 0.6: MDL1.8 30.34,36.06 32.09,37.81 RSENS_WIFI.1
VDDA  (via drill 0.38)
  Top 0.4: IC1.9 v21.59,15.06
  Bottom 0.4: L1.2 21.19,14.66 | C13.1 21.19,14.51 21.19,14.66 | 21.19,14.66 v21.59,15.06
WIFI_BL2
  Top 0.2: IC1.20 26.34,18.56 28.09,16.81 33.84,16.81 34.34,17.31 MDL1.11
WIFI_BL15  (via drill 0.38)
  Top 0.2: v26.09,20.31 31.09,20.31 32.34,19.06 MDL1.10 | IC1.26 22.59,21.31 v22.34,21.06
  Bottom 0.2: v26.09,20.31 23.09,20.31 v22.34,21.06
WIFI_BOOT
  Top 0.2: IC1.18 25.84,17.56 27.59,15.81 35.09,15.81 36.34,17.06 MDL1.12
WIFI_ENA  (via drill 0.38)
  Top 0.2: v32.34,22.81 40.34,30.81 MDL1.3 | IC1.25 25.59,22.31 27.09,20.81 30.09,20.81 v30.34,21.06
  Bottom 0.2: v30.34,21.06 30.59,21.06 v32.34,22.81
WIFI_IO4  (via drill 0.38)
  Top 0.2: IC1.15 25.84,16.06 27.09,14.81 36.09,14.81 v36.59,15.31 | v38.09,16.81 38.09,18.36 MDL1.13
  Bottom 0.2: v36.59,15.31 v38.09,16.81
WIFI_IO5  (via drill 0.38)
  Top 0.2: IC1.14 25.59,15.56 26.84,14.31 37.34,14.31 37.59,14.06 v37.59,14.31 | v39.09,15.81 40.34,17.06 MDL1.14
  Bottom 0.2: v37.59,14.31 v39.09,15.81
WIFI_POW_ENA  (via drill 0.38)
  Top 0.2: U$5.1 36.86,42.29 37.34,41.81 37.34,32.56 35.59,30.81 27.09,30.81 26.84,30.56 26.84,29.06 25.59,27.81 v25.09,27.81 | IC1.32 19.59,23.81 21.09,25.31 26.09,25.31 v26.59,25.81
  Bottom 0.2: v25.09,27.81 26.59,26.31 v26.59,25.81
WIFI_RES  (via drill 0.38)
  Top 0.2: IC1.19 26.09,18.06 27.84,16.31 34.84,16.31 35.34,16.81 v35.34,20.31 | MDL1.1 44.34,32.31 v35.34,23.31
  Bottom 0.2: v35.34,23.31 v35.34,20.31
WIFI_RX
  Top 0.2: IC1.31 20.09,23.56 21.34,24.81 29.84,24.81 31.09,23.56 31.09,22.31 31.84,21.56 33.09,21.56 33.59,22.06 41.34,22.06 44.34,19.06 MDL1.16 44.54,18.61 46.09,17.06 46.96,17.06 JP5.10
WIFI_TX
  Top 0.2: IC1.30 20.59,23.31 21.59,24.31 25.59,24.31 27.09,22.81 29.84,22.81 31.59,21.06 33.34,21.06 33.84,21.56 39.84,21.56 41.84,19.56 41.84,19.11 MDL1.15 42.34,17.81 43.09,17.06 45.22,17.06 46.97,15.31 48.83,15.31 JP5.9

### Text on the board
_tsilk: SBAT | DC5V | WS5V | BAT- | BAT+ | ILIM | 5V | 3.3V | TMR | NTC | SMAIN | ISET | REV B | SWIFI | WSGND | 3.3V | GY-85 | wisleep | WSSIG | STM32F1 | 8MHz | 32kHz | DEBUG | www.pelleplutt.com | LED | RESET
_bsilk: S5V | SCPU